# Altium schematic sheet m_airconditioner_SCH.SchDoc
size B; PageSetup: Record=PageOptions|CenterHorizontal=True|CenterVertical=True|PrintScale=0.72|XCorrection=1.00|YCorrection=1.00|PrintKind=1|BorderSize=5000000|LeftOffset=0|BottomOffset=0|Orientation=2|PaperLength=1000|PaperWidth=1000|Scale=100|PaperSource=7|PrintQuality=-4|MediaType=1|DitherType=10|PrintScaleMode=0|PaperKind=Letter|PaperIndex=1
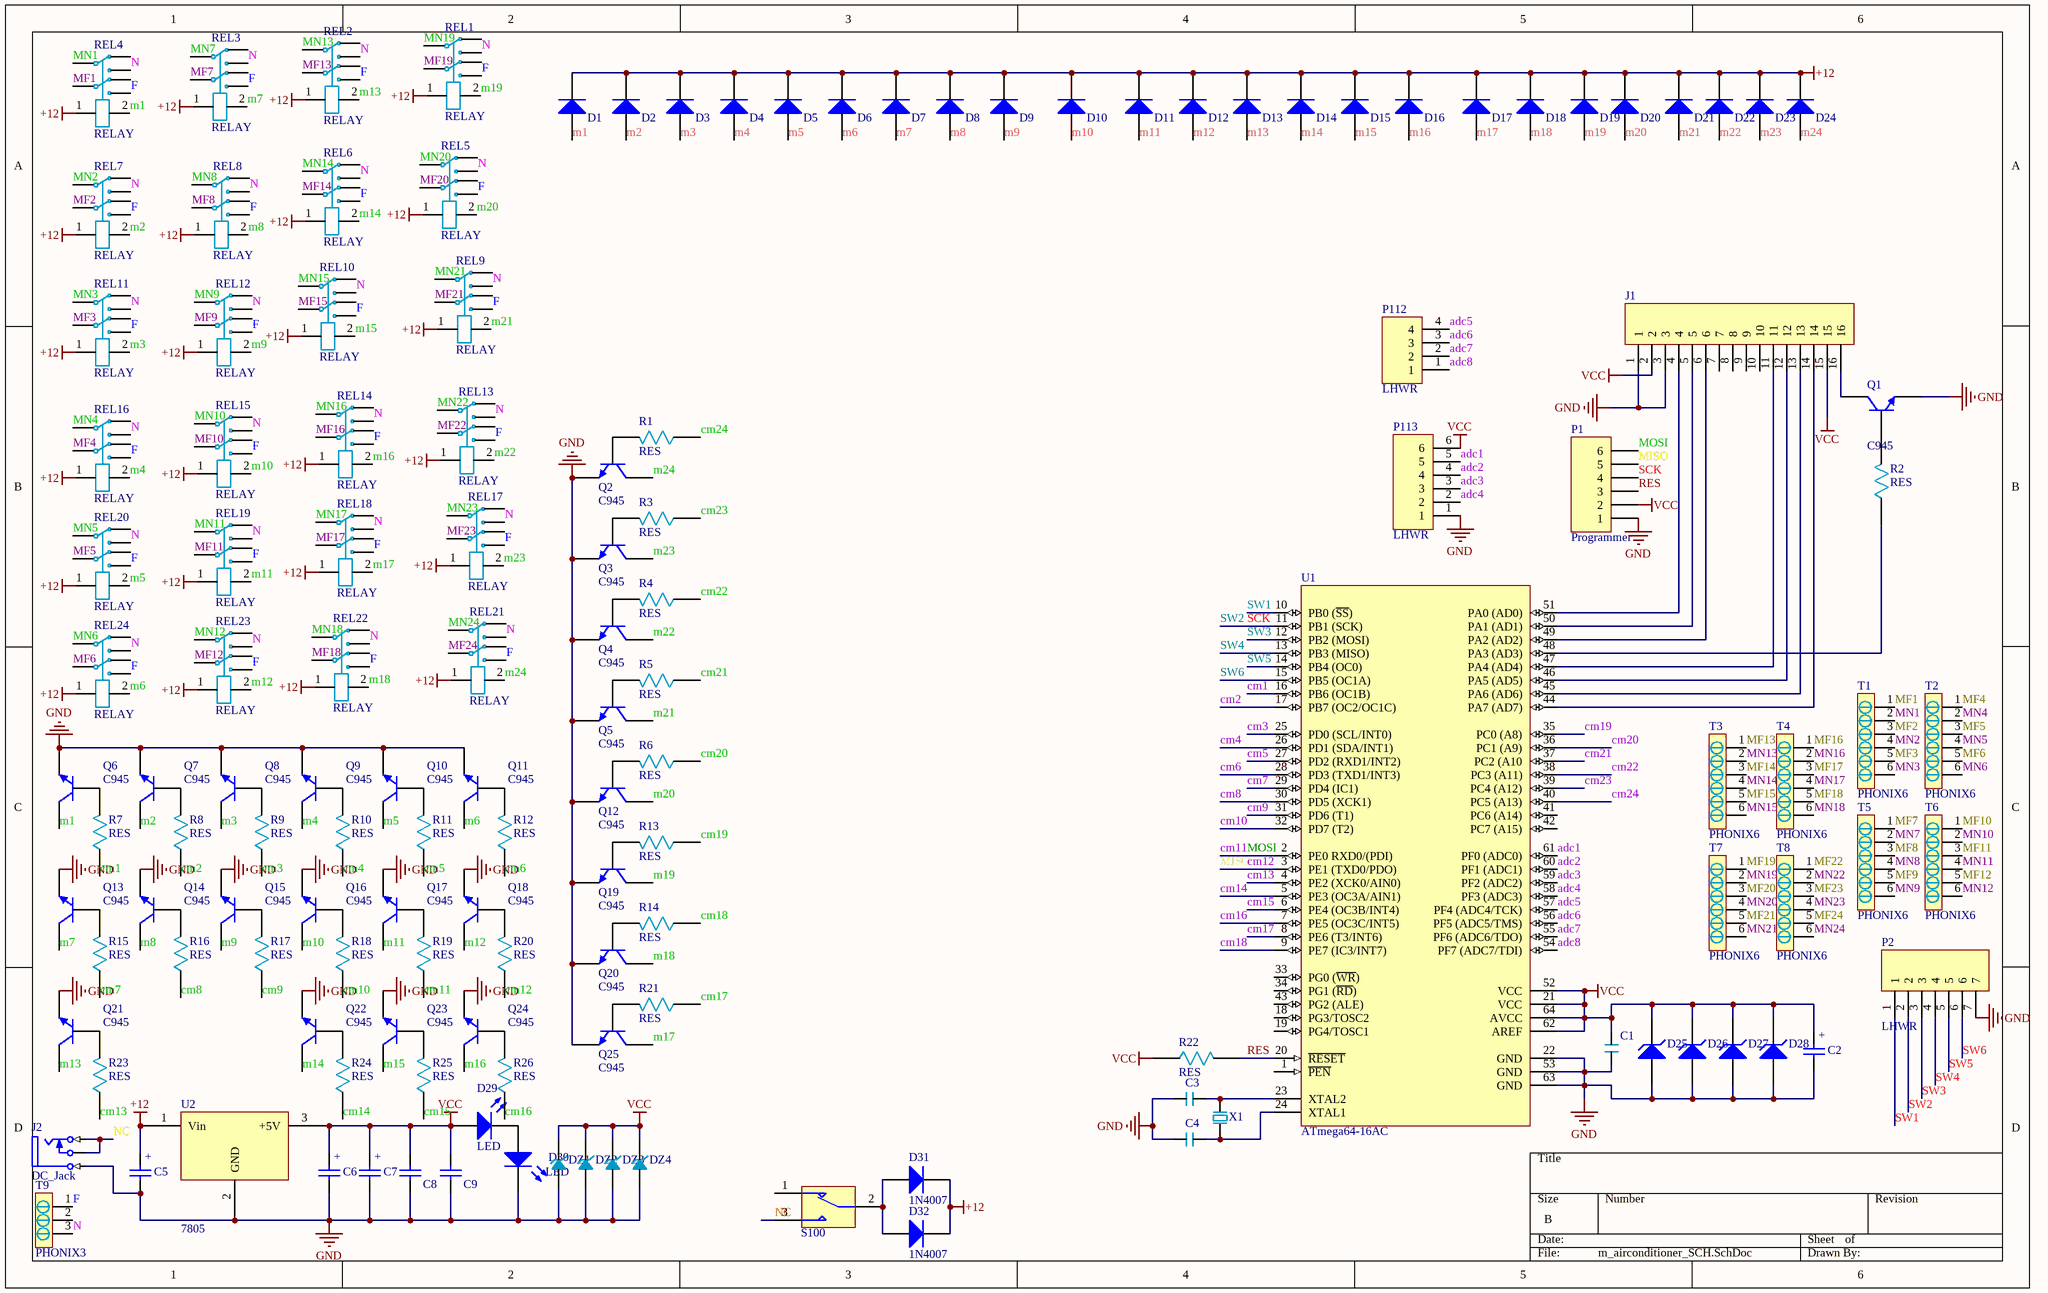
[diagram p0: m_airconditioner_SCH.SchDoc]

## Parts
C1  (no value)  [RAD_ADA]
C2  Cap  [My_cap3300u]  (value not drawn)
C3  CAP  [RAD_ADA]  (value not drawn)
C4  CAP  [RAD_ADA]  (value not drawn)
C5  Cap  [My_cap3300u]  (value not drawn)
C6  Cap  [My_cap3300u]  (value not drawn)
C7  Cap  [My_cap3300u]  (value not drawn)
C8  Cap  [My_cap100n]  (value not drawn)
C9  Cap  [My_cap100n]  (value not drawn)
D1  1N4007  [My_DO-41]  (value not drawn)
D2  1N4007  [My_DO-41]  (value not drawn)
D3  1N4007  [My_DO-41]  (value not drawn)
D4  1N4007  [My_DO-41]  (value not drawn)
D5  1N4007  [My_DO-41]  (value not drawn)
D6  1N4007  [My_DO-41]  (value not drawn)
D7  1N4007  [My_DO-41]  (value not drawn)
D8  1N4007  [My_DO-41]  (value not drawn)
D9  1N4007  [My_DO-41]  (value not drawn)
D10  1N4007  [My_DO-41]  (value not drawn)
D11  1N4007  [My_DO-41]  (value not drawn)
D12  1N4007  [My_DO-41]  (value not drawn)
D13  1N4007  [My_DO-41]  (value not drawn)
D14  1N4007  [My_DO-41]  (value not drawn)
D15  1N4007  [My_DO-41]  (value not drawn)
D16  1N4007  [My_DO-41]  (value not drawn)
D17  1N4007  [My_DO-41]  (value not drawn)
D18  1N4007  [My_DO-41]  (value not drawn)
D19  1N4007  [My_DO-41]  (value not drawn)
D20  1N4007  [My_DO-41]  (value not drawn)
D21  1N4007  [My_DO-41]  (value not drawn)
D22  1N4007  [My_DO-41]  (value not drawn)
D23  1N4007  [My_DO-41]  (value not drawn)
D24  1N4007  [My_DO-41]  (value not drawn)
D25  5V  [DIODE-0.7]  (value not drawn)
D26  5v  [DIODE-0.7]  (value not drawn)
D27  5V  [DIODE-0.7]  (value not drawn)
D28  5V  [DIODE-0.7]  (value not drawn)
D29  LED  [My_LED3MM]
D30  LED  [My_LED3MM]
D31  1N4007  [My_DO-41]
D32  1N4007  [My_DO-41]
DZ1  ZENER  [ZENER]  (value not drawn)
DZ2  ZENER  [ZENER]  (value not drawn)
DZ3  ZENER  [ZENER]  (value not drawn)
DZ4  ZENER  [ZENER]  (value not drawn)
J1  SIP16  [SIP16]  (value not drawn)
J2  DC_Jack  [My_DC_Jack]
P1  Programmer  [HDR1X6]
P2  LHWR  [Polarized Header 7]
P112  LHWR  [Polarized Header 4]
P113  LHWR  [Polarized Header 6]
Q1  C945  [C945]
Q2  C945  [C945]
Q3  C945  [C945]
Q4  C945  [C945]
Q5  C945  [C945]
Q6  C945  [C945]
Q7  C945  [C945]
Q8  C945  [C945]
Q9  C945  [C945]
Q10  C945  [C945]
Q11  C945  [C945]
Q12  C945  [C945]
Q13  C945  [C945]
Q14  C945  [C945]
Q15  C945  [C945]
Q16  C945  [C945]
Q17  C945  [C945]
Q18  C945  [C945]
Q19  C945  [C945]
Q20  C945  [C945]
Q21  C945  [C945]
Q22  C945  [C945]
Q23  C945  [C945]
Q24  C945  [C945]
Q25  C945  [C945]
R1  RES  [AXIAL_V]
R2  RES  [AXIAL0.4]
R3  RES  [AXIAL_V]
R4  RES  [AXIAL_V]
R5  RES  [AXIAL_V]
R6  RES  [AXIAL_V]
R7  RES  [AXIAL_V]
R8  RES  [AXIAL_V]
R9  RES  [AXIAL_V]
R10  RES  [AXIAL_V]
R11  RES  [AXIAL_V]
R12  RES  [AXIAL_V]
R13  RES  [AXIAL_V]
R14  RES  [AXIAL_V]
R15  RES  [AXIAL_V]
R16  RES  [AXIAL_V]
R17  RES  [AXIAL_V]
R18  RES  [AXIAL_V]
R19  RES  [AXIAL_V]
R20  RES  [AXIAL_V]
R21  RES  [AXIAL_V]
R22  RES  [AXIAL0.4]
R23  RES  [AXIAL_V]
R24  RES  [AXIAL_V]
R25  RES  [AXIAL_V]
R26  RES  [AXIAL_V]
REL1  RELAY  [RELAY1]
REL2  RELAY  [RELAY1]
REL3  RELAY  [RELAY1]
REL4  RELAY  [RELAY1]
REL5  RELAY  [RELAY1]
REL6  RELAY  [RELAY1]
REL7  RELAY  [RELAY1]
REL8  RELAY  [RELAY1]
REL9  RELAY  [RELAY1]
REL10  RELAY  [RELAY1]
REL11  RELAY  [RELAY1]
REL12  RELAY  [RELAY1]
REL13  RELAY  [RELAY1]
REL14  RELAY  [RELAY1]
REL15  RELAY  [RELAY1]
REL16  RELAY  [RELAY1]
REL17  RELAY  [RELAY1]
REL18  RELAY  [RELAY1]
REL19  RELAY  [RELAY1]
REL20  RELAY  [RELAY1]
REL21  RELAY  [RELAY1]
REL22  RELAY  [RELAY1]
REL23  RELAY  [RELAY1]
REL24  RELAY  [RELAY1]
S100  Switch SPDT_Subminiator  [SPDT Subminiator]  (value not drawn)
T1  PHONIX6  [PHONIX6]
T2  PHONIX6  [PHONIX6]
T3  PHONIX6  [PHONIX6]
T4  PHONIX6  [PHONIX6]
T5  PHONIX6  [PHONIX6]
T6  PHONIX6  [PHONIX6]
T7  PHONIX6  [PHONIX6]
T8  PHONIX6  [PHONIX6]
T9  PHONIX3  [PHONIX3]
U1  ATmega64-16AC  [64A_N]
U2  7805  [My_TO-220]
X1  XTAL  [XTAL_1]  (value not drawn)

## Nets
+12: C5.+ D1.K D2.K D3.K D4.K D5.K D6.K D7.K D8.K D9.K D10.K D11.K D12.K D13.K D14.K D15.K D16.K D17.K D18.K D19.K D20.K D21.K D22.K D23.K D24.K D31.K D32.K REL1.1 REL2.1 REL3.1 REL4.1 REL5.1 REL6.1 REL7.1 REL8.1 REL9.1 REL10.1 REL11.1 REL12.1 REL13.1 REL14.1 REL15.1 REL16.1 REL17.1 REL18.1 REL19.1 REL20.1 REL21.1 REL22.1 REL23.1 REL24.1 U2.1(Vin)
GND: C1.1 C2.- C3.1 C4.1 C5.- C6.- C7.- C8.2 C9.2 D25.1(A) D26.1(A) D27.1(A) D28.1(A) D30.K DZ1.1 DZ2.1 DZ3.1 DZ4.1 J1.1 J1.3 J2.3(S) P1.1 P2.7 P113.1 Q1.1(E) Q2.1(E) Q3.1(E) Q4.1(E) Q5.1(E) Q6.1(E) Q7.1(E) Q8.1(E) Q9.1(E) Q10.1(E) Q11.1(E) Q12.1(E) Q13.1(E) Q14.1(E) Q15.1(E) Q16.1(E) Q17.1(E) Q18.1(E) Q19.1(E) Q20.1(E) Q21.1(E) Q22.1(E) Q23.1(E) Q24.1(E) Q25.1(E) U1.22(GND) U1.53(GND) U1.63(GND) U2.2(GND)
VCC: C1.2 C2.+ C6.+ C7.+ C8.1 C9.1 D25.2(K) D26.2(K) D27.2(K) D28.2(K) D29.A DZ1.2 DZ2.2 DZ3.2 DZ4.2 J1.2 J1.15 P1.2 P113.6 R22.1 U1.21(VCC) U1.52(VCC) U1.62(AREF) U1.64(AVCC) U2.3(+5V)
adc1: P113.5 U1.61(PF0_(ADC0))
adc2: P113.4 U1.60(PF1_(ADC1))
adc3: P113.3 U1.59(PF2_(ADC2))
adc4: P113.2 U1.58(PF3_(ADC3))
adc5: P112.4 U1.57(PF4_(ADC4/TCK))
adc6: P112.3 U1.56(PF5_(ADC5/TMS))
adc7: P112.2 U1.55(PF6_(ADC6/TDO))
adc8: P112.1 U1.54(PF7_(ADC7/TDI))
cm1: R7.1 U1.16(PB6_(OC1B))
cm2: R8.1 U1.17(PB7_(OC2/OC1C))
cm3: R9.1 U1.25(PD0_(SCL/INT0))
cm4: R10.1 U1.26(PD1_(SDA/INT1))
cm5: R11.1 U1.27(PD2_(RXD1/INT2))
cm6: R12.1 U1.28(PD3_(TXD1/INT3))
cm7: R15.1 U1.29(PD4_(IC1))
cm8: R16.1 U1.30(PD5_(XCK1))
cm9: R17.1 U1.31(PD6_(T1))
cm10: R18.1 U1.32(PD7_(T2))
cm11: P1.6 R19.1 U1.2(PE0_RXD0/(PDI))  [also labelled MOSI]
cm12: P1.5 R20.1 U1.3(PE1_(TXD0/PDO))  [also labelled MISO]
cm13: R23.1 U1.4(PE2_(XCK0/AIN0))
cm14: R24.1 U1.5(PE3_(OC3A/AIN1))
cm15: R25.1 U1.6(PE4_(OC3B/INT4))
cm16: R26.1 U1.7(PE5_(OC3C/INT5))
cm17: R21.1 U1.8(PE6_(T3/INT6))
cm18: R14.1 U1.9(PE7_(IC3/INT7))
cm19: R13.1 U1.35(PC0_(A8))
cm20: R6.1 U1.36(PC1_(A9))
cm21: R5.1 U1.37(PC2_(A10)
cm22: R4.1 U1.38(PC3_(A11))
cm23: R3.1 U1.39(PC4_(A12))
cm24: R1.1 U1.40(PC5_(A13))
F: REL1.5 REL2.5 REL3.5 REL4.5 REL5.5 REL6.5 REL7.5 REL8.5 REL9.5 REL10.5 REL11.5 REL12.5 REL13.5 REL14.5 REL15.5 REL16.5 REL17.5 REL18.5 REL19.5 REL20.5 REL21.5 REL22.5 REL23.5 REL24.5 T9.1
m1: D1.A Q6.2(C) REL4.2
m2: D2.A Q7.2(C) REL7.2
m3: D3.A Q8.2(C) REL11.2
m4: D4.A Q9.2(C) REL16.2
m5: D5.A Q10.2(C) REL20.2
m6: D6.A Q11.2(C) REL24.2
m7: D7.A Q13.2(C) REL3.2
m8: D8.A Q14.2(C) REL8.2
m9: D9.A Q15.2(C) REL12.2
m10: D10.A Q16.2(C) REL15.2
m11: D11.A Q17.2(C) REL19.2
m12: D12.A Q18.2(C) REL23.2
m13: D13.A Q21.2(C) REL2.2
m14: D14.A Q22.2(C) REL6.2
m15: D15.A Q23.2(C) REL10.2
m16: D16.A Q24.2(C) REL14.2
m17: D17.A Q25.2(C) REL18.2
m18: D18.A Q20.2(C) REL22.2
m19: D19.A Q19.2(C) REL1.2
m20: D20.A Q12.2(C) REL5.2
m21: D21.A Q5.2(C) REL9.2
m22: D22.A Q4.2(C) REL13.2
m23: D23.A Q3.2(C) REL17.2
m24: D24.A Q2.2(C) REL21.2
MF1: REL4.3 T1.1
MF2: REL7.3 T1.3
MF3: REL11.3 T1.5
MF4: REL16.3 T2.1
MF5: REL20.3 T2.3
MF6: REL24.3 T2.5
MF7: REL3.3 T5.1
MF8: REL8.3 T5.3
MF9: REL12.3 T5.5
MF10: REL15.3 T6.1
MF11: REL19.3 T6.3
MF12: REL23.3 T6.5
MF13: REL2.3 T3.1
MF14: REL6.3 T3.3
MF15: REL10.3 T3.5
MF16: REL14.3 T4.1
MF17: REL18.3 T4.3
MF18: REL22.3 T4.5
MF19: REL1.3 T7.1
MF20: REL5.3 T7.3
MF21: REL9.3 T7.5
MF22: REL13.3 T8.1
MF23: REL17.3 T8.3
MF24: REL21.3 T8.5
MN1: REL4.4 T1.2
MN2: REL7.4 T1.4
MN3: REL11.4 T1.6
MN4: REL16.4 T2.2
MN5: REL20.4 T2.4
MN6: REL24.4 T2.6
MN7: REL3.4 T5.2
MN8: REL8.4 T5.4
MN9: REL12.4 T5.6
MN10: REL15.4 T6.2
MN11: REL19.4 T6.4
MN12: REL23.4 T6.6
MN13: REL2.4 T3.2
MN14: REL6.4 T3.4
MN15: REL10.4 T3.6
MN16: REL14.4 T4.2
MN17: REL18.4 T4.4
MN18: REL22.4 T4.6
MN19: REL1.4 T7.2
MN20: REL5.4 T7.4
MN21: REL9.4 T7.6
MN22: REL13.4 T8.2
MN23: REL17.4 T8.4
MN24: REL21.4 T8.6
N: REL1.7 REL2.7 REL3.7 REL4.7 REL5.7 REL6.7 REL7.7 REL8.7 REL9.7 REL10.7 REL11.7 REL12.7 REL13.7 REL14.7 REL15.7 REL16.7 REL17.7 REL18.7 REL19.7 REL20.7 REL21.7 REL22.7 REL23.7 REL24.7 T9.3
NC: J2.1(T) J2.2(TN) S100.3
RES: P1.3 R22.2 U1.20(~{RESET})
SCK: P1.4 P2.2 U1.11(PB1_(SCK))  [also labelled SW2]
SW1: P2.1 U1.10(PB0_(~{SS}))
SW3: P2.3 U1.12(PB2_(MOSI))
SW4: P2.4 U1.13(PB3_(MISO))
SW5: P2.5 U1.14(PB4_(OC0))
SW6: P2.6 U1.15(PB5_(OC1A))
NetC3_2: C3.2 U1.23(XTAL2) X1.2
NetC4_2: C4.2 U1.24(XTAL1) X1.1
NetD29_K: D29.K D30.A
NetD31_A: D31.A D32.A S100.2
NetJ1_4: J1.4 U1.51(PA0_(AD0))
NetJ1_5: J1.5 U1.50(PA1_(AD1))
NetJ1_6: J1.6 U1.49(PA2_(AD2))
NetJ1_11: J1.11 U1.47(PA4_(AD4))
NetJ1_12: J1.12 U1.46(PA5_(AD5))
NetJ1_13: J1.13 U1.45(PA6_(AD6))
NetJ1_14: J1.14 U1.44(PA7_(AD7))
NetJ1_16: J1.16 Q1.2(C)
NetQ1_3: Q1.3(B) R2.2
NetQ2_3: Q2.3(B) R1.2
NetQ3_3: Q3.3(B) R3.2
NetQ4_3: Q4.3(B) R4.2
NetQ5_3: Q5.3(B) R5.2
NetQ6_3: Q6.3(B) R7.2
NetQ7_3: Q7.3(B) R8.2
NetQ8_3: Q8.3(B) R9.2
NetQ9_3: Q9.3(B) R10.2
NetQ10_3: Q10.3(B) R11.2
NetQ11_3: Q11.3(B) R12.2
NetQ12_3: Q12.3(B) R6.2
NetQ13_3: Q13.3(B) R15.2
NetQ14_3: Q14.3(B) R16.2
NetQ15_3: Q15.3(B) R17.2
NetQ16_3: Q16.3(B) R18.2
NetQ17_3: Q17.3(B) R19.2
NetQ18_3: Q18.3(B) R20.2
NetQ19_3: Q19.3(B) R13.2
NetQ20_3: Q20.3(B) R14.2
NetQ21_3: Q21.3(B) R23.2
NetQ22_3: Q22.3(B) R24.2
NetQ23_3: Q23.3(B) R25.2
NetQ24_3: Q24.3(B) R26.2
NetQ25_3: Q25.3(B) R21.2
NetR2_1: R2.1 U1.48(PA3_(AD3))

Not connected (* = marked no-connect by the designer): J1 7 8 9 10; REL1 6 8; REL2 6 8; REL3 6 8; REL4 6 8; REL5 6 8; REL6 6 8; REL7 6 8; REL8 6 8; REL9 6 8; REL10 6 8; REL11 6 8; REL12 6 8; REL13 6 8; REL14 6 8; REL15 6 8; REL16 6 8; REL17 6 8; REL18 6 8; REL19 6 8; REL20 6 8; REL21 6 8; REL22 6 8; REL23 6 8; REL24 6 8; S100 1; T9 2; U1 1(~{PEN}) 18(PG3/TOSC2) 19(PG4/TOSC1) 33(PG0_(~{WR})) 34(PG1_(~{RD})) 41(PC6_(A14)) 42(PC7_(A15)) 43(PG2_(ALE))

## Library data of the parts
C1 = CAP: value: 100nf
C2 C5-C7 = Cap Pol: CAP-3300Uf; Value: 3300u
C8 C9 = Cap ceramic: CAP-100Nf; Value: 100nF
D1-D24 D31 D32 = 1N4007: 1 Amp Diode
D25-D28 = D Zener: Zener Diode; Published: 8-Jun-2000; LatestRevisionDate: 17-Jul-2002; LatestRevisionNote: Re-released for DXP Platform.; PackageReference: DIODE-0.7; Publisher: Altium Limited; PackageDescription: Diode, Thru-Hole; 2 Leads; 0.7 in Pin Spacing
D29 D30 = LED: Typical INFRARED GaAs LED; Published: 8-Jun-2000; LatestRevisionDate: 08-Jul-2005; LatestRevisionNote: Mech Layer 1 removed.; Publisher: Altium Limited
J2 = DC_Jack: PackageDocument: 2003; PCB_Layout: Complies with manufacturer's recommendation.; DrillAndSlotSize: Corresponds to nominal value.; LatestRevisionDate: 15-Jul-2004; LatestRevisionNote: Component Replaced & renamed from "Phonejack".; DatasheetDocument: 2003; PackageReference: S1VS_SNB; Publisher: Altium Limited; ComponentLink1Description: Manufacturer Link; ComponentLink1URL: http://www.cliffuk.co.uk/
P1 = Header 6: Header, 6-Pin; LatestRevisionDate: 17-Jul-2002; LatestRevisionNote: Re-released for DXP Platform.; Publisher: Altium Limited
P2 = 7pin LHWR: Designer:: Hamed Jafarzadeh - www.R2T.ir
P112 = 4pin LHWR: Designer:: Hamed Jafarzadeh - www.R2T.ir
P113 = 6pin LHWR: Designer:: Hamed Jafarzadeh - www.R2T.ir
Q1-Q25 = C945: NPN Transistor; Designer: Saeid Jorablo; Company: IPA CO; Last Update Time: 2008/08/04; Value: C945
S100 = Switch SPDT_Subminiator: Subminiator SPDT Switch; Company: E.P.I.L; Design date: 2011/11/02
U1 = ATmega64-16AC: 8-Bit AVR Microcontroller with 64K Bytes of In-System Programmable Flash Memory; Published: 17-Sep-2003; LatestRevisionDate: 13-Apr-2006; LatestRevisionNote: IPC-7351 Footprint Added.; DatasheetVersion: 2490C-AVR-009/02; PackageVersion: revB, Oct-2001; PackageReference: 64A; Publisher: Altium Limited; PackageDescription: 64-Pin Thin Quad Flat Pack 0.8 mm Pitch; Code_JEDEC: MS-026-AEB; ComponentLink1Description: Manufacturer Link; ComponentLink1URL: http://www.atmel.com; ComponentLink2Description: Datasheet; ComponentLink2URL: http://www.atmel.com/dyn/resources/prod_documents/doc2490.pdf
U2 = 7805: Regulator